# Altium schematic sheet LED7seg.SchDoc
size A; SheetNumber: 2; SheetTotal: 2
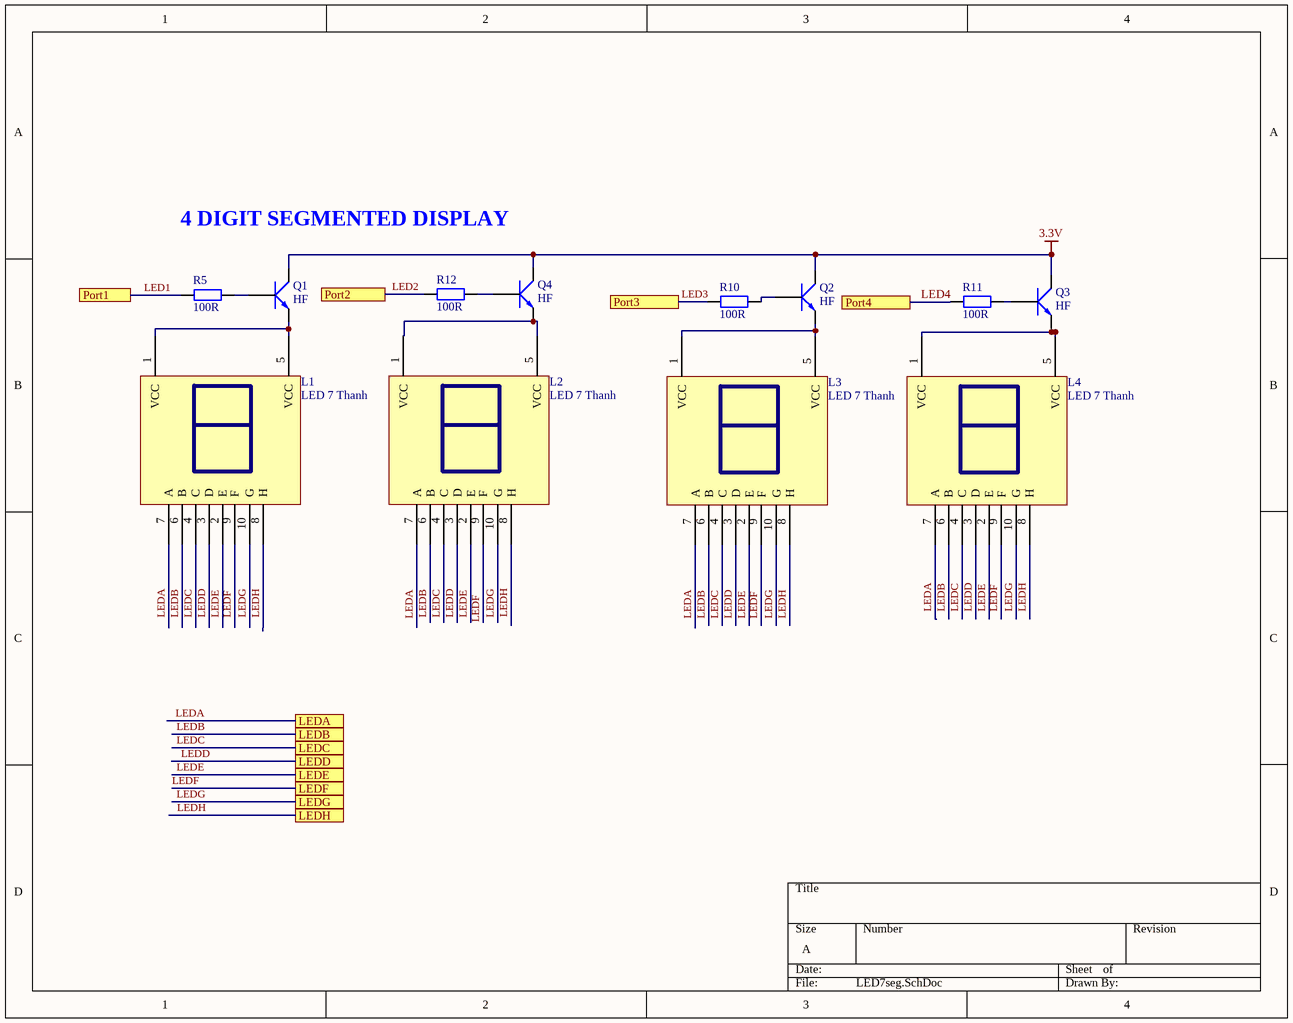
[diagram p0: LED7seg.SchDoc]

## Parts
L1  LED 7 Thanh  [LED7SEG_2.3inch]
L2  LED 7 Thanh  [LED7SEG_2.3inch]
L3  LED 7 Thanh  [LED7SEG_2.3inch]
L4  LED 7 Thanh  [LED7SEG_2.3inch]
Q1  HF  [SOT23]
Q2  HF  [SOT23]
Q3  HF  [SOT23]
Q4  HF  [SOT23]
R5  100R  [tro smd 0805]
R10  100R  [tro smd 0805]
R11  100R  [tro smd 0805]
R12  100R  [tro smd 0805]

## Ports
LEDA, LEDB, LEDC, LEDD, LEDE, LEDF, LEDG, LEDH, Port1, Port2, Port3, Port4

## Nets
3.3V: Q1.3(C) Q2.3(C) Q3.3(C) Q4.3(C)
LED1: R5.1 ; port Port1
LED2: R12.1 ; port Port2
LED3: R10.1 ; port Port3
LED4: R11.1 ; port Port4
LEDA: L1.7(A) L2.7(A) L3.7(A) L4.7(A) ; port LEDA
LEDB: L1.6(B) L2.6(B) L3.6(B) L4.6(B) ; port LEDB
LEDC: L1.4(C) L2.4(C) L3.4(C) L4.4(C) ; port LEDC
LEDD: L1.3(D) L2.3(D) L3.3(D) L4.3(D) ; port LEDD
LEDE: L1.2(E) L2.2(E) L3.2(E) L4.2(E) ; port LEDE
LEDF: L1.9(F) L2.9(F) L3.9(F) L4.9(F) ; port LEDF
LEDG: L1.10(G) L2.10(G) L3.10(G) L4.10(G) ; port LEDG
LEDH: L1.8(H) L2.8(H) L3.8(H) L4.8(H) ; port LEDH
NetL1_1: L1.1(VCC) L1.5(VCC) Q1.2(E)
NetL2_1: L2.1(VCC) L2.5(VCC) Q4.2(E)
NetL3_1: L3.1(VCC) L3.5(VCC) Q2.2(E)
NetL4_1: L4.1(VCC) L4.5(VCC) Q3.2(E)
NetQ1_1: Q1.1(B) R5.2
NetQ2_1: Q2.1(B) R10.2
NetQ3_1: Q3.1(B) R11.2
NetQ4_1: Q4.1(B) R12.2

## Notes on the sheet
- 4 DIGIT SEGMENTED DISPLAY

## Library data of the parts
L1-L4 = LED 7x1 2.3inch Anot: Dán; Don_Vi: Con; Ma_Hang: MH000901; Ten_Linh_Kien: Led 7 2.3 1 Số Anot (Sáng Đỏ); Ghi_Chu: *; Kieu_Chan: *; Chung_Loai: Dán
Q1-Q4 = C1815 HF SMD: NPN transistor; Value: C9014
R5 R10-R12 = Tro 0805 5% 100R: Dán; Don_Vi: Con; So_Chan: 2; Ten_Linh_Kien: Trở 0805 5% 100R; Ma_Hang: MH005251; Chung_Loai: Dán; Kieu_Chan: *